# Altium project UDAC.PrjPcb
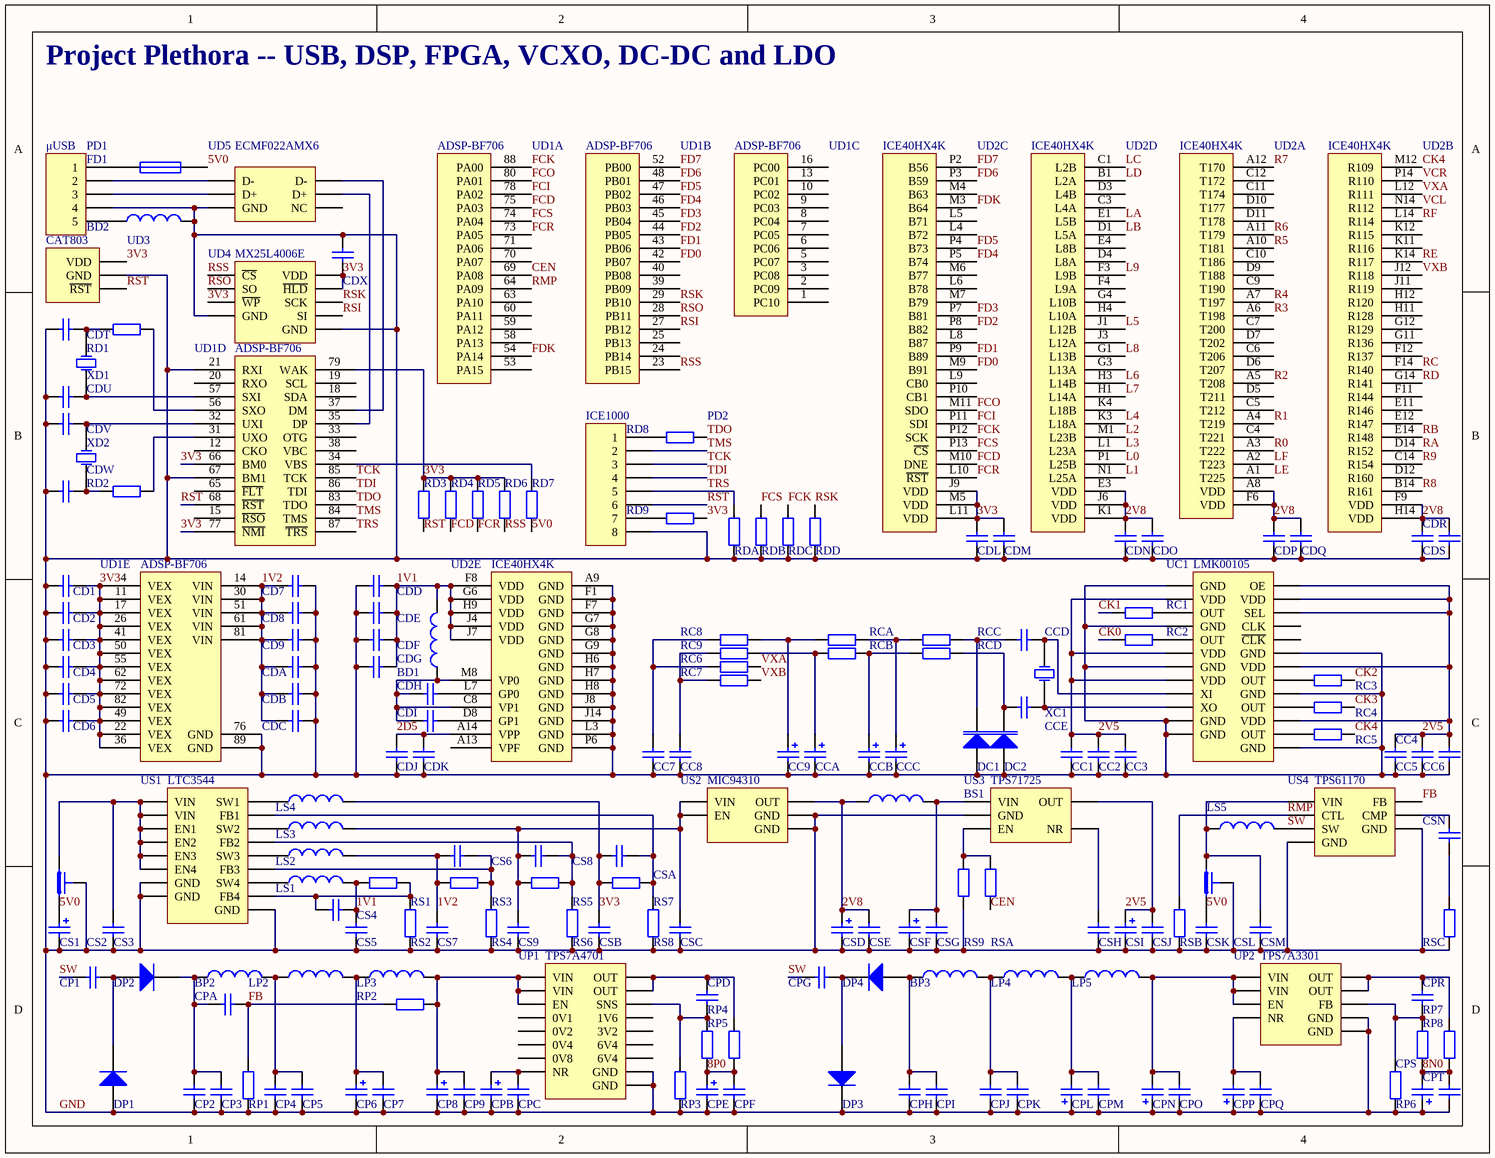
[diagram p0: USB.SchDoc]
2 sheets, 401 parts. Net scope: global (net labels, ports and power ports of the same name join across sheets).
Sheets:
  USB.SchDoc
  DAC.SchDoc

## Sheet USB.SchDoc
size Letter

### Parts
BD1  Inductor  [0402]  (value not drawn)
BD2  Inductor  [0402]  (value not drawn)
BP2  Inductor  [0402]  (value not drawn)
BP3  Inductor  [0402]  (value not drawn)
BS1  Inductor  [0402]  (value not drawn)
CC1  Cap  [0603]  (value not drawn)
CC2  Cap  [0402]  (value not drawn)
CC3  Cap  [0402]  (value not drawn)
CC4  Cap  [0402]  (value not drawn)
CC5  Cap  [0402]  (value not drawn)
CC6  Cap  [0402]  (value not drawn)
CC7  Cap  [0402]  (value not drawn)
CC8  Cap  [0402]  (value not drawn)
CC9  Cap Pol2  [0603]  (value not drawn)
CCA  Cap Pol2  [0603]  (value not drawn)
CCB  Cap Pol2  [0603]  (value not drawn)
CCC  Cap Pol2  [0603]  (value not drawn)
CCD  Cap  [0402]  (value not drawn)
CCE  Cap  [0402]  (value not drawn)
CD1  Cap  [0402]  (value not drawn)
CD2  Cap  [0402]  (value not drawn)
CD3  Cap  [0402]  (value not drawn)
CD4  Cap  [0402]  (value not drawn)
CD5  Cap  [0402]  (value not drawn)
CD6  Cap  [0402]  (value not drawn)
CD7  Cap  [0402]  (value not drawn)
CD8  Cap  [0402]  (value not drawn)
CD9  Cap  [0402]  (value not drawn)
CDA  Cap  [0402]  (value not drawn)
CDB  Cap  [0402]  (value not drawn)
CDC  Cap  [0402]  (value not drawn)
CDD  Cap  [0402]  (value not drawn)
CDE  Cap  [0402]  (value not drawn)
CDF  Cap  [0402]  (value not drawn)
CDG  Cap  [0402]  (value not drawn)
CDH  Cap  [0402]  (value not drawn)
CDI  Cap  [0402]  (value not drawn)
CDJ  Cap  [0402]  (value not drawn)
CDK  Cap  [0402]  (value not drawn)
CDL  Cap  [0402]  (value not drawn)
CDM  Cap  [0402]  (value not drawn)
CDN  Cap  [0402]  (value not drawn)
CDO  Cap  [0402]  (value not drawn)
CDP  Cap  [0402]  (value not drawn)
CDQ  Cap  [0402]  (value not drawn)
CDR  Cap  [0402]  (value not drawn)
CDS  Cap  [0402]  (value not drawn)
CDT  Cap  [0402]  (value not drawn)
CDU  Cap  [0402]  (value not drawn)
CDV  Cap  [0402]  (value not drawn)
CDW  Cap  [0402]  (value not drawn)
CDX  Cap  [0402]  (value not drawn)
CP1  Cap  [0402]  (value not drawn)
CP2  Cap  [0805]  (value not drawn)
CP3  Cap  [0805]  (value not drawn)
CP4  Cap  [0805]  (value not drawn)
CP5  Cap  [0805]  (value not drawn)
CP6  Cap Pol2  [6032]  (value not drawn)
CP7  Cap  [0805]  (value not drawn)
CP8  Cap Pol2  [6032]  (value not drawn)
CP9  Cap  [0805]  (value not drawn)
CPA  Cap  [0402]  (value not drawn)
CPB  Cap Pol2  [0603]  (value not drawn)
CPC  Cap  [0603]  (value not drawn)
CPD  Cap  [0402]  (value not drawn)
CPE  Cap Pol2  [6032]  (value not drawn)
CPF  Cap  [0805]  (value not drawn)
CPG  Cap  [0402]  (value not drawn)
CPH  Cap  [0805]  (value not drawn)
CPI  Cap  [0805]  (value not drawn)
CPJ  Cap  [0805]  (value not drawn)
CPK  Cap  [0805]  (value not drawn)
CPL  Cap Pol2  [6032]  (value not drawn)
CPM  Cap  [0805]  (value not drawn)
CPN  Cap Pol2  [6032]  (value not drawn)
CPO  Cap  [0805]  (value not drawn)
CPP  Cap Pol2  [0603]  (value not drawn)
CPQ  Cap  [0603]  (value not drawn)
CPR  Cap  [0402]  (value not drawn)
CPS  Cap Pol2  [6032]  (value not drawn)
CPT  Cap  [0805]  (value not drawn)
CS1  Cap Pol2  [0603]  (value not drawn)
CS2  Cap Feed  [0603F]  (value not drawn)
CS3  Cap  [0402]  (value not drawn)
CS4  Cap  [0402]  (value not drawn)
CS5  Cap  [0603]  (value not drawn)
CS6  Cap  [0402]  (value not drawn)
CS7  Cap  [0603]  (value not drawn)
CS8  Cap  [0402]  (value not drawn)
CS9  Cap  [0603]  (value not drawn)
CSA  Cap  [0402]  (value not drawn)
CSB  Cap  [0603]  (value not drawn)
CSC  Cap  [0402]  (value not drawn)
CSD  Cap Pol2  [0603]  (value not drawn)
CSE  Cap  [0603]  (value not drawn)
CSF  Cap Pol2  [0603]  (value not drawn)
CSG  Cap  [0603]  (value not drawn)
CSH  Cap  [0603]  (value not drawn)
CSI  Cap Pol2  [0603]  (value not drawn)
CSJ  Cap  [0603]  (value not drawn)
CSK  Cap  [0402]  (value not drawn)
CSL  Cap Feed  [0603F]  (value not drawn)
CSM  Cap  [0402]  (value not drawn)
CSN  Cap  [0402]  (value not drawn)
DC1  D Varactor  [SOD523]  (value not drawn)
DC2  D Varactor  [SOD523]  (value not drawn)
DP1  Diode  [SOD882]  (value not drawn)
DP2  Diode  [SOD882]  (value not drawn)
DP3  Diode  [SOD882]  (value not drawn)
DP4  Diode  [SOD882]  (value not drawn)
FD1  Fuse 1  [0402]  (value not drawn)
LP2  Inductor  [1210]  (value not drawn)
LP3  Inductor  [1210]  (value not drawn)
LP4  Inductor  [1210]  (value not drawn)
LP5  Inductor  [1210]  (value not drawn)
LS1  Inductor  [0805]  (value not drawn)
LS2  Inductor  [0805]  (value not drawn)
LS3  Inductor  [0805]  (value not drawn)
LS4  Inductor  [0805]  (value not drawn)
LS5  Inductor  [SRP2010]  (value not drawn)
PD1  μUSB  [HDR1X5]
PD2  ICE1000  [SOLO9188]
RC1  Res2  [0402]  (value not drawn)
RC2  Res2  [0402]  (value not drawn)
RC3  Res2  [0402]  (value not drawn)
RC4  Res2  [0402]  (value not drawn)
RC5  Res2  [0402]  (value not drawn)
RC6  Res2  [0402]  (value not drawn)
RC7  Res2  [0402]  (value not drawn)
RC8  Res2  [0402]  (value not drawn)
RC9  Res2  [0402]  (value not drawn)
RCA  Res2  [0402]  (value not drawn)
RCB  Res2  [0402]  (value not drawn)
RCC  Res2  [0402]  (value not drawn)
RCD  Res2  [0402]  (value not drawn)
RD1  Res2  [0402]  (value not drawn)
RD2  Res2  [0402]  (value not drawn)
RD3  Res2  [0402]  (value not drawn)
RD4  Res2  [0402]  (value not drawn)
RD5  Res2  [0402]  (value not drawn)
RD6  Res2  [0402]  (value not drawn)
RD7  Res2  [0402]  (value not drawn)
RD8  Res2  [0402]  (value not drawn)
RD9  Res2  [0402]  (value not drawn)
RDA  Res2  [0402]  (value not drawn)
RDB  Res2  [0402]  (value not drawn)
RDC  Res2  [0402]  (value not drawn)
RDD  Res2  [0402]  (value not drawn)
RP1  Res2  [0402]  (value not drawn)
RP2  Res2  [0402]  (value not drawn)
RP3  Res2  [0402]  (value not drawn)
RP4  Res2  [0402]  (value not drawn)
RP5  Res2  [0402]  (value not drawn)
RP6  Res2  [0402]  (value not drawn)
RP7  Res2  [0402]  (value not drawn)
RP8  Res2  [0402]  (value not drawn)
RS1  Res2  [0402]  (value not drawn)
RS2  Res2  [0402]  (value not drawn)
RS3  Res2  [0402]  (value not drawn)
RS4  Res2  [0402]  (value not drawn)
RS5  Res2  [0402]  (value not drawn)
RS6  Res2  [0402]  (value not drawn)
RS7  Res2  [0402]  (value not drawn)
RS8  Res2  [0402]  (value not drawn)
RS9  Res2  [0402]  (value not drawn)
RSA  Res2  [0402]  (value not drawn)
RSB  Res2  [0402]  (value not drawn)
RSC  Res2  [0402]  (value not drawn)
UC1  LMK00105  [QFN24]
UD1  ADSP-BF706  [QFN88]  (parts A,B,C,D,E of 5)
UD2  ICE40HX4K  [BGA132]  (parts A,B,C,D,E of 5)
UD3  CAT803  [SC70]
UD4  MX25L4006E  [UDFN8]
UD5  ECMF022AMX6  [UDFN6]
UP1  TPS7A4701  [QFN20]
UP2  TPS7A3301  [QFN20]
US1  LTC3544  [QFN16]
US2  MIC94310  [DFN4]
US3  TPS71725  [SC705]
US4  TPS61170  [DFN6]
XC1  XTAL  [2520]  (value not drawn)
XD1  XTAL  [2016]  (value not drawn)
XD2  XTAL  [2016]  (value not drawn)

### Nets
1V1: BD1.2 CDD.1 CDE.1 CDF.1 CDG.1 CS4.2 CS5.1 LS1.2 RS1.1 UD2.F8(VDD) UD2.G6(VDD) UD2.H9(VDD) UD2.J4(VDD) UD2.J7(VDD)
1V2: CD7.2 CD8.2 CD9.2 CDA.2 CDB.2 CDC.2 CS6.1 CS7.1 LS2.2 RS3.1 UD1.14(VIN) UD1.30(VIN) UD1.51(VIN) UD1.61(VIN) UD1.81(VIN)
2D5: CDJ.2 CDK.2 UD2.A14(VPP)
2V5: CC1.2 CC2.2 CC3.2 CC4.2 CC5.2 CC6.2 CSI.1 CSJ.2 UC1.2(VDD) UC1.6(VDD) UC1.8(VDD) UC1.14(VDD) UC1.18(VDD) UC1.22(SEL) UC1.23(VDD) UC1.24(OE) US3.5(OUT)
2V8: BS1.1 CDN.2 CDO.2 CDP.2 CDQ.2 CDR.2 CDS.2 CSD.1 CSE.2 UD2.A8(VDD) UD2.E3(VDD) UD2.F6(VDD) UD2.F9(VDD) UD2.H14(VDD) UD2.J6(VDD) UD2.K1(VDD) US2.1(OUT)
3V3: CD1.1 CD2.1 CD3.1 CD4.1 CD5.1 CD6.1 CDL.2 CDM.2 CDX.1 CSA.1 CSB.1 LS4.2 RD3.2 RD4.2 RD5.2 RD6.2 RD9.2 RS7.1 UD1.4(VEX) UD1.11(VEX) UD1.17(VEX) UD1.22(VEX) UD1.26(VEX) UD1.36(VEX) UD1.41(VEX) UD1.49(VEX) UD1.50(VEX) UD1.55(VEX) UD1.62(VEX) UD1.66(BM0) UD1.72(VEX) UD1.77(~{NMI}) UD1.79(WAK) UD1.82(VEX) UD2.J9(VDD) UD2.L11(VDD) UD2.M5(VDD) UD3.1(VDD) UD4.3(~{WP}) UD4.7(~{HLD}) UD4.8(VDD)
5V0: CS1.1 CS2.1 CSK.2 CSL.1 FD1.1 RD7.1
8N0: CPS.2 CPT.2 RP7.1 RP8.1
8P0: CPE.1 CPF.2 RP4.1 RP5.1
CEN: RSA.1 UD1.69(PA08)
CK0: RC2.1
CK1: RC1.1
CK2: RC3.2
CK3: RC4.2
CK4: RC5.2 UD2.M12(R109)
FB: CPA.1 RP1.2 RP2.1 US4.1(FB)
FCD: RD4.1 UD1.75(PA03) UD2.M10(DNE)
FCI: UD1.78(PA02) UD2.P11(SDI)
FCK: RDC.2 UD1.88(PA00) UD2.P12(SCK)
FCO: UD1.80(PA01) UD2.M11(SDO)
FCR: RD5.1 UD1.73(PA05) UD2.L10(~{RST})
FCS: RDB.2 UD1.74(PA04) UD2.P13(~{CS})
FD0: UD1.42(PB07) UD2.M9(B91)
FD1: UD1.43(PB06) UD2.P9(B89)
FD2: UD1.44(PB05) UD2.P8(B82)
FD3: UD1.45(PB04) UD2.P7(B81)
FD4: UD1.46(PB03) UD2.P5(B74)
FD5: UD1.47(PB02) UD2.P4(B73)
FD6: UD1.48(PB01) UD2.P3(B59)
FD7: UD1.52(PB00) UD2.P2(B56)
FDK: UD1.54(PA14) UD2.M3(B64)
GND: BD2.2 CC1.1 CC2.1 CC3.1 CC4.1 CC5.1 CC6.1 CC7.1 CC8.1 CC9.2 CCA.2 CCB.2 CCC.2 CD1.2 CD2.2 CD3.2 CD4.2 CD5.2 CD6.2 CD7.1 CD8.1 CD9.1 CDA.1 CDB.1 CDC.1 CDD.2 CDE.2 CDF.2 CDG.2 CDJ.1 CDK.1 CDL.1 CDM.1 CDN.1 CDO.1 CDP.1 CDQ.1 CDR.1 CDS.1 CDT.1 CDU.1 CDV.1 CDW.1 CDX.2 CP2.1 CP3.1 CP4.1 CP5.1 CP6.2 CP7.1 CP8.2 CP9.1 CPB.2 CPC.1 CPE.2 CPF.1 CPH.1 CPI.1 CPJ.1 CPK.1 CPL.1 CPM.1 CPN.1 CPO.1 CPP.1 CPQ.1 CPS.1 CPT.1 CS1.2 CS2.3 CS3.2 CS5.2 CS7.2 CS9.2 CSB.2 CSC.1 CSD.2 CSE.1 CSF.2 CSG.1 CSH.1 CSI.2 CSJ.1 CSK.1 CSL.3 CSM.1 DC1.3(A) DC2.3(A) DP1.1(A) DP3.2(K) PD1.4 PD2.8 RDA.1 RDB.1 RDC.1 RDD.1 RP1.1 RP3.2 RP6.1 RS2.1 RS4.1 RS6.1 RS8.1 RS9.1 RSB.1 RSC.1 UC1.1(GND) UC1.4(GND) UC1.7(GND) UC1.11(GND) UC1.12(GND) UC1.16(GND) UC1.19(GND) UC1.25(GND) UD1.21(RXI) UD1.67(BM1) UD1.76(GND) UD1.89(GND) UD2.A9(GND) UD2.F1(GND) UD2.F7(GND) UD2.G7(GND) UD2.G8(GND) UD2.G9(GND) UD2.H6(GND) UD2.H7(GND) UD2.H8(GND) UD2.J8(GND) UD2.J14(GND) UD2.L3(GND) UD2.P6(GND) UD3.2(GND) UD4.4(GND) UD4.9(GND) UD5.3(GND) UP1.7(GND) UP1.21(GND) UP2.7(GND) UP2.21(GND) US1.6(GND) US1.14(GND) US1.17(GND) US2.2(GND) US2.5(GND) US3.2(GND) US4.3(GND) US4.7(GND)
L0: UD2.P1(L25B)
L1: UD2.N1(L25A)
L2: UD2.M1(L23B)
L3: UD2.L1(L23A)
L4: UD2.K3(L18A)
L5: UD2.J1(L12B)
L6: UD2.H3(L14B)
L7: UD2.H1(L14A)
L8: UD2.G1(L13B)
L9: UD2.F3(L9B)
LA: UD2.E1(L5B)
LB: UD2.D1(L5A)
LC: UD2.C1(L2B)
LD: UD2.B1(L2A)
LE: UD2.A1(T225)
LF: UD2.A2(T223)
R0: UD2.A3(T222)
R1: UD2.A4(T219)
R2: UD2.A5(T208)
R3: UD2.A6(T198)
R4: UD2.A7(T197)
R5: UD2.A10(T181)
R6: UD2.A11(T179)
R7: UD2.A12(T170)
R8: UD2.B14(R161)
R9: UD2.C14(R154)
RA: UD2.D14(R152)
RB: UD2.E14(R148)
RC: UD2.F14(R140)
RD: UD2.G14(R141)
RE: UD2.K14(R117)
RF: UD2.L14(R114)
RMP: RSB.2 UD1.64(PA09) US4.5(CTL)
RSI: UD1.27(PB12) UD4.5(SI)
RSK: RDD.2 UD1.29(PB10) UD4.6(SCK)
RSO: UD1.28(PB11) UD4.2(SO)
RSS: RD6.1 UD1.23(PB15) UD4.1(~{CS})
RST: PD2.6 RD3.1 UD1.68(~{RST}) UD3.3(~{RST})
SW: CP1.1 CPG.1 LS5.2 US4.4(SW)
TCK: PD2.3 UD1.85(TCK)
TDI: PD2.4 UD1.86(TDI)
TDO: RD8.2 UD1.83(TDO)
TMS: PD2.2 UD1.84(TMS)
TRS: PD2.5 RDA.2 UD1.87(~{TRS})
VCL: UD2.N14(R112)
VCR: UD2.P14(R110)
VXA: RC6.2 UD2.L12(R111)
VXB: RC7.2 UD2.J12(R118)
NetBD1_1: BD1.1 CDH.1 CDI.1 UD2.C8(VP1) UD2.M8(VP0)
NetBD2_1: BD2.1 PD1.5
NetBP2_1: BP2.1 CP2.2 CP3.2 CPA.2 DP2.2(K)
NetBP2_2: BP2.2 CP4.2 CP5.2 LP2.1
NetBP3_1: BP3.1 CPH.2 CPI.2 DP4.1(A)
NetBP3_2: BP3.2 CPJ.2 CPK.2 LP4.1
NetBS1_2: BS1.2 CSF.1 CSG.2 US3.1(VIN)
NetCC7_2: CC7.2 RC6.1 RC8.1
NetCC8_2: CC8.2 RC7.1 RC9.1
NetCC9_1: CC9.1 RC8.2 RCA.1
NetCCA_1: CCA.1 RC9.2 RCB.1
NetCCB_1: CCB.1 RCB.2 RCD.1
NetCCC_1: CCC.1 RCA.2 RCC.1
NetCCD_1: CCD.1 DC1.1(K) RCC.2
NetCCD_2: CCD.2 UC1.9(XI) XC1.2(OSC2)
NetCCE_1: CCE.1 DC2.1(K) RCD.2
NetCCE_2: CCE.2 UC1.10(XO) XC1.1(OSC1)
NetCDH_2: CDH.2 UD2.L7(GP0)
NetCDI_2: CDI.2 UD2.D8(GP1)
NetCDT_2: CDT.2 RD1.1 XD1.2(OSC2)
NetCDU_2: CDU.2 UD1.57(SXI) XD1.1(OSC1)
NetCDV_2: CDV.2 UD1.32(UXI) XD2.2(OSC2)
NetCDW_2: CDW.2 RD2.1 XD2.1(OSC1)
NetCP1_2: CP1.2 DP1.2(K) DP2.1(A)
NetCP6_1: CP6.1 CP7.2 LP2.2 LP3.1
NetCP8_1: CP8.1 CP9.2 LP3.2 RP2.2 UP1.13(EN) UP1.15(VIN) UP1.16(VIN)
NetCPB_1: CPB.1 CPC.2 UP1.14(NR)
NetCPD_1: CPD.1 RP3.1 RP4.2 UP1.3(SNS)
NetCPD_2: CPD.2 RP5.2 UP1.1(OUT) UP1.20(OUT)
NetCPG_2: CPG.2 DP3.1(A) DP4.2(K)
NetCPL_2: CPL.2 CPM.2 LP4.2 LP5.1
NetCPN_2: CPN.2 CPO.2 LP5.2 UP2.13(EN) UP2.15(VIN) UP2.16(VIN)
NetCPP_2: CPP.2 CPQ.2 UP2.14(NR)
NetCPR_1: CPR.1 RP6.2 RP7.2 UP2.3(FB)
NetCPR_2: CPR.2 RP8.2 UP2.1(OUT) UP2.20(OUT)
NetCS2_2: CS2.2 CS3.1 US1.3(EN2) US1.7(VIN) US1.9(EN4) US1.12(EN1) US1.15(VIN) US1.16(EN3)
NetCS4_1: CS4.1 RS1.2 RS2.2 US1.10(FB4)
NetCS6_2: CS6.2 RS3.2 RS4.2 US1.1(FB3)
NetCS8_1: CS8.1 CS9.1 CSC.2 LS3.2 RS5.1 US2.3(EN) US2.4(VIN)
NetCS8_2: CS8.2 RS5.2 RS6.2 US1.2(FB2)
NetCSA_2: CSA.2 RS7.2 RS8.2 US1.11(FB1)
NetCSH_2: CSH.2 US3.4(NR)
NetCSL_2: CSL.2 CSM.2 LS5.1 US4.6(VIN)
NetCSN_1: CSN.1 RSC.2
NetCSN_2: CSN.2 US4.2(CMP)
NetFD1_2: FD1.2 PD1.1
NetLS1_1: LS1.1 US1.8(SW4)
NetLS2_1: LS2.1 US1.4(SW3)
NetLS3_1: LS3.1 US1.5(SW2)
NetLS4_1: LS4.1 US1.13(SW1)
NetPD1_2: PD1.2 UD5.1(D-)
NetPD1_3: PD1.3 UD5.2(D+)
NetPD2_1: PD2.1 RD8.1
NetPD2_7: PD2.7 RD9.1
NetRC1_2: RC1.2 UC1.3(OUT)
NetRC2_2: RC2.2 UC1.5(OUT)
NetRC3_1: RC3.1 UC1.17(OUT)
NetRC4_1: RC4.1 UC1.15(OUT)
NetRC5_1: RC5.1 UC1.13(OUT)
NetRD1_2: RD1.2 UD1.56(SXO)
NetRD2_2: RD2.2 UD1.31(UXO)
NetRD7_2: RD7.2 UD1.34(VBS)
NetRS9_2: RS9.2 RSA.2 US3.3(EN)
NetUD1_35: UD1.35(DP) UD5.5(D+)
NetUD1_37: UD1.37(DM) UD5.6(D-)

Not connected (* = marked no-connect by the designer): UC1 20(~{CLK}) 21(CLK); UD1 1(PC10) 2(PC09) 3(PC08) 5(PC07) 6(PC06) 7(PC05) 8(PC04) 9(PC03) 10(PC02) 12(CKO) 13(PC01) 15(~{RSO}) 16(PC00) 18(SDA) 19(SCL) 20(RXO) 24(PB14) 25(PB13) 33(OTG) 38(VBC) 39(PB09) 40(PB08) 53(PA15) 58(PA13) 59(PA12) 60(PA11) 63(PA10) 65(~{FLT}) 70(PA07) 71(PA06); UD2 A13(VPF) C3(L4A) C4(T221) C5(T212) C6(T206) C7(T200) C9(T190) C10(T186) C11(T174) C12(T172) D3(L4B) D4(L8A) D5(T211) D6(T207) D7(T202) D9(T188) D10(T177) D11(T178) D12(R160) E4(L8B) E11(R146) E12(R147) F4(L9A) F11(R144) F12(R137) G3(L13A) G4(L10B) G11(R136) G12(R129) H4(L10A) H11(R128) H12(R120) J3(L12A) J11(R119) K4(L18B) K11(R116) K12(R115) L4(B72) L5(B71) L6(B78) L8(B87) L9(CB0) M4(B63) M6(B77) M7(B79) P10(CB1); UD5 4(NC); UP1 4(6V4) 5(6V4) 6(3V2) 8(1V6) 9(0V8) 10(0V4) 11(0V2) 12(0V1)

### Notes on the sheet
- Project Plethora -- USB, DSP, FPGA, VCXO, DC-DC and LDO

### Library data of the parts
BD1 BD2 BP2 BP3 BS1 LP2-LP5 LS1-LS5 = Inductor: Code_IEC: 1005; Value: 10mH; Published: 8-Jun-2000; LatestRevisionDate: 29-May-2009; LatestRevisionNote: IPC-7351 Footprint Added.; PackageReference: 0402-A; Publisher: Altium Limited; PackageDescription: Chip Inductor; Code_JEITA: 0402
CC1-CC8 CCD CCE CD1-CD9 CDA CDB CDC CDD CDE CDF CDG CDH CDI CDJ CDK CDL CDM CDN CDO CDP CDQ CDR CDS CDT CDU CDV CDW CDX CP1-CP5 CP7 CP9 CPA CPC CPD CPF CPG CPH CPI CPJ CPK CPM CPO CPQ CPR CPT CS3-CS9 CSA CSB CSC CSE CSG CSH CSJ CSK CSM CSN = Cap: Capacitor; Value: 100pF; Published: 8-Jun-2000; LatestRevisionDate: 17-Jul-2002; LatestRevisionNote: Re-released for DXP Platform.; PackageReference: RAD-0.3; Publisher: Altium Limited; PackageDescription: Radial Cap, Thru-Hole; 2 Leads; 0.3 in Pin Spacing
CC9 CCA CCB CCC CP6 CP8 CPB CPE CPL CPN CPP CPS CS1 CSD CSF CSI = Cap Pol2: Polarized Capacitor (Axial); Value: 100pF; Published: 8-Jun-2000; LatestRevisionDate: 17-Jul-2002; LatestRevisionNote: Re-released for DXP Platform.; PackageReference: POLAR0.8; Publisher: Altium Limited; PackageDescription: Polarized Capacitor; 2 Leads
CS2 CSL = Cap Feed: Feed-Through Capacitor; Note: Commonly used for bypassing high-frequency currents to chassis; Value: 100pF; Published: 24-Mar-1999; LatestRevisionDate: 17-Jul-2002; LatestRevisionNote: Re-released for DXP Platform.; PackageReference: VR4; Publisher: Altium Limited; PackageDescription: Variable Resistor, Thru-Hole; 3 Leads
DC1 DC2 = D Varactor: Variable Capacitance Diode; Note: Pin 2 is not connected and not drawn.; Published: 8-Jun-2000; LatestRevisionDate: 29-May-2009; LatestRevisionNote: IPC-7351 Footprint Added.; DatasheetVersion: Jan-1998; PackageVersion: 1996; PackageReference: SOT23A; Publisher: Altium Limited; PackageDescription: 3-Pin SOT-23 Package 0.95 mm Pitch, 2.3 mm Lead Span - Reverse Pinning; ComponentLink1Description: Manufacturer Link; ComponentLink1URL: http://www.zetex.com/
DP1-DP4 = Diode: Default Diode; Published: 8-Jun-2000; LatestRevisionDate: 17-Jul-2002; LatestRevisionNote: Re-released for DXP Platform.; PackageVersion: Sep-1996; PackageReference: SMC; Publisher: Altium Limited; PackageDescription: DO-214-AB/SMC; 2 C-Bend Leads; Body 7.9 x 5.9 mm, inc. leads (LxW); Code_JEDEC: DO-214-AB
FD1 = Fuse 1: Fuse; Published: 8-Jun-2000; LatestRevisionDate: 17-Jul-2002; LatestRevisionNote: Re-released for DXP Platform.; PackageReference: PIN-W2/E2.8; Publisher: Altium Limited; PackageDescription: Thru-Hole; 2 Leads
PD1 = Header 5: Header, 5-Pin; LatestRevisionDate: 17-Jul-2002; LatestRevisionNote: Re-released for DXP Platform.; Publisher: Altium Limited
PD2 = Header 8: Header, 8-Pin; LatestRevisionDate: 17-Jul-2002; LatestRevisionNote: Re-released for DXP Platform.; Publisher: Altium Limited
RC1-RC9 RCA RCB RCC RCD RD1-RD9 RDA RDB RDC RDD RP1-RP8 RS1-RS9 RSA RSB RSC = Res2: Resistor; Value: 1K; Published: 8-Jun-2000; LatestRevisionDate: 17-Jul-2002; LatestRevisionNote: Re-released for DXP Platform.; PackageReference: AXIAL-0.4; Publisher: Altium Limited; PackageDescription: Axial Device, Thru-Hole; 2 Leads; 0.4 in Pin Spacing
UD2 = ICE40HX4K: Manufacturer: Lattice Semiconductor; PartNumber: ICE40HX4K-CB132; Embedded RAM Bits: 80K; Logic Cells: 3520; Packing: Tray; Phase-Locked Loops: 2; Supply Voltage: 1.2V; DatasheetVersion: Rev. 02.9; PackageVersion: Rev. 03.9, 02/2013; PackageReference: csBGA-132; PackageDescription: 132-Ball Chip Scale Ball Grid Array, Body 8 x 8 mm, Pitch 0.5 mm; Supplier 1: Digi-Key; Supplier Part Number 1: 220-1571-ND; Supplier 2: Farnell; Supplier Part Number 2: 2252859; Supplier 3: Newark; Supplier Part Number 3: 48W5878; Supplier 4: Mouser; Supplier Part Number 4: 842-ICE40HX4K-CB132; RoHS: TRUE; Mounting Technology: Surface Mount; ComponentLink1Description: Manufacturer URL; ComponentLink1URL: http://www.latticesemi.com/en; ComponentLink2Description: Datasheet; ComponentLink2URL: http://www.latticesemi.com/~/media/Documents/DataSheets/iCE/iCE40LPHXFamilyDataSheet.pdf; ComponentLink3Description: Package Specification; ComponentLink3URL: http://www.latticesemi.com/lit/docs/package/pkg.pdf
XC1 XD1 XD2 = XTAL: Crystal Oscillator; Published: 8-Jun-2000; LatestRevisionDate: 17-Jul-2002; LatestRevisionNote: Re-released for DXP Platform.; PackageReference: R38; Publisher: Altium Limited; PackageDescription: Crystal, Thru-Hole; 2 Leads; Body 3.1 x 8.2 mm (Dia.xH)

## Sheet DAC.SchDoc
size Letter
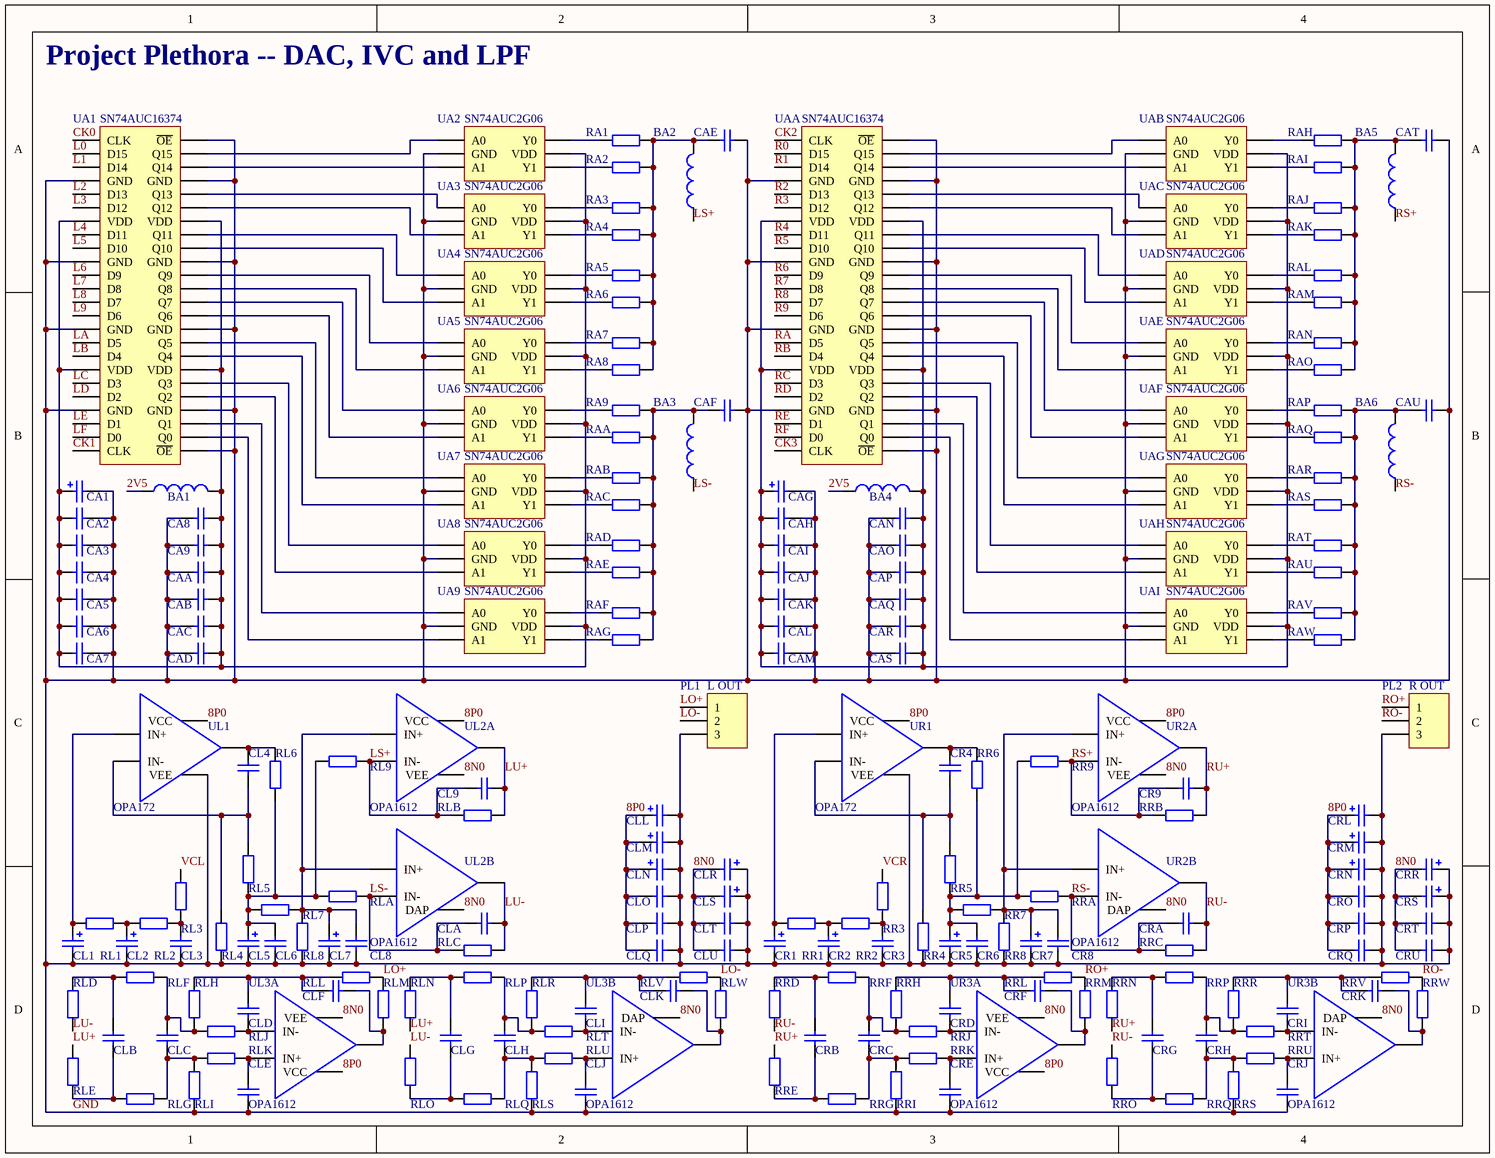
[diagram p1: DAC.SchDoc]

### Parts
BA1  Inductor  [0402]  (value not drawn)
BA2  Inductor  [0402]  (value not drawn)
BA3  Inductor  [0402]  (value not drawn)
BA4  Inductor  [0402]  (value not drawn)
BA5  Inductor  [0402]  (value not drawn)
BA6  Inductor  [0402]  (value not drawn)
CA1  Cap Pol2  [0603]  (value not drawn)
CA2  Cap  [0402]  (value not drawn)
CA3  Cap  [0402]  (value not drawn)
CA4  Cap  [0402]  (value not drawn)
CA5  Cap  [0402]  (value not drawn)
CA6  Cap  [0402]  (value not drawn)
CA7  Cap  [0402]  (value not drawn)
CA8  Cap  [0402]  (value not drawn)
CA9  Cap  [0402]  (value not drawn)
CAA  Cap  [0402]  (value not drawn)
CAB  Cap  [0402]  (value not drawn)
CAC  Cap  [0402]  (value not drawn)
CAD  Cap  [0402]  (value not drawn)
CAE  Cap  [0402]  (value not drawn)
CAF  Cap  [0402]  (value not drawn)
CAG  Cap Pol2  [0603]  (value not drawn)
CAH  Cap  [0402]  (value not drawn)
CAI  Cap  [0402]  (value not drawn)
CAJ  Cap  [0402]  (value not drawn)
CAK  Cap  [0402]  (value not drawn)
CAL  Cap  [0402]  (value not drawn)
CAM  Cap  [0402]  (value not drawn)
CAN  Cap  [0402]  (value not drawn)
CAO  Cap  [0402]  (value not drawn)
CAP  Cap  [0402]  (value not drawn)
CAQ  Cap  [0402]  (value not drawn)
CAR  Cap  [0402]  (value not drawn)
CAS  Cap  [0402]  (value not drawn)
CAT  Cap  [0402]  (value not drawn)
CAU  Cap  [0402]  (value not drawn)
CL1  Cap Pol2  [0603]  (value not drawn)
CL2  Cap Pol2  [0603]  (value not drawn)
CL3  Cap  [0603]  (value not drawn)
CL4  Cap  [0603]  (value not drawn)
CL5  Cap Pol2  [0603]  (value not drawn)
CL6  Cap  [0603]  (value not drawn)
CL7  Cap Pol2  [0603]  (value not drawn)
CL8  Cap  [0603]  (value not drawn)
CL9  Cap  [0603]  (value not drawn)
CLA  Cap  [0603]  (value not drawn)
CLB  Cap  [0603]  (value not drawn)
CLC  Cap  [0603]  (value not drawn)
CLD  Cap  [0603]  (value not drawn)
CLE  Cap  [0603]  (value not drawn)
CLF  Cap  [0603]  (value not drawn)
CLG  Cap  [0603]  (value not drawn)
CLH  Cap  [0603]  (value not drawn)
CLI  Cap  [0603]  (value not drawn)
CLJ  Cap  [0603]  (value not drawn)
CLK  Cap  [0603]  (value not drawn)
CLL  Cap Pol2  [0603]  (value not drawn)
CLM  Cap Pol2  [0603]  (value not drawn)
CLN  Cap Pol2  [0603]  (value not drawn)
CLO  Cap  [0603]  (value not drawn)
CLP  Cap  [0603]  (value not drawn)
CLQ  Cap  [0603]  (value not drawn)
CLR  Cap Pol2  [0603]  (value not drawn)
CLS  Cap Pol2  [0603]  (value not drawn)
CLT  Cap  [0603]  (value not drawn)
CLU  Cap  [0603]  (value not drawn)
CR1  Cap Pol2  [0603]  (value not drawn)
CR2  Cap Pol2  [0603]  (value not drawn)
CR3  Cap  [0603]  (value not drawn)
CR4  Cap  [0603]  (value not drawn)
CR5  Cap Pol2  [0603]  (value not drawn)
CR6  Cap  [0603]  (value not drawn)
CR7  Cap Pol2  [0603]  (value not drawn)
CR8  Cap  [0603]  (value not drawn)
CR9  Cap  [0603]  (value not drawn)
CRA  Cap  [0603]  (value not drawn)
CRB  Cap  [0603]  (value not drawn)
CRC  Cap  [0603]  (value not drawn)
CRD  Cap  [0603]  (value not drawn)
CRE  Cap  [0603]  (value not drawn)
CRF  Cap  [0603]  (value not drawn)
CRG  Cap  [0603]  (value not drawn)
CRH  Cap  [0603]  (value not drawn)
CRI  Cap  [0603]  (value not drawn)
CRJ  Cap  [0603]  (value not drawn)
CRK  Cap  [0603]  (value not drawn)
CRL  Cap Pol2  [0603]  (value not drawn)
CRM  Cap Pol2  [0603]  (value not drawn)
CRN  Cap Pol2  [0603]  (value not drawn)
CRO  Cap  [0603]  (value not drawn)
CRP  Cap  [0603]  (value not drawn)
CRQ  Cap  [0603]  (value not drawn)
CRR  Cap Pol2  [0603]  (value not drawn)
CRS  Cap Pol2  [0603]  (value not drawn)
CRT  Cap  [0603]  (value not drawn)
CRU  Cap  [0603]  (value not drawn)
PL1  L OUT  [HDR1X3]
PL2  R OUT  [HDR1X3]
RA1  Res2  [0402]  (value not drawn)
RA2  Res2  [0402]  (value not drawn)
RA3  Res2  [0402]  (value not drawn)
RA4  Res2  [0402]  (value not drawn)
RA5  Res2  [0402]  (value not drawn)
RA6  Res2  [0402]  (value not drawn)
RA7  Res2  [0402]  (value not drawn)
RA8  Res2  [0402]  (value not drawn)
RA9  Res2  [0402]  (value not drawn)
RAA  Res2  [0402]  (value not drawn)
RAB  Res2  [0402]  (value not drawn)
RAC  Res2  [0402]  (value not drawn)
RAD  Res2  [0402]  (value not drawn)
RAE  Res2  [0402]  (value not drawn)
RAF  Res2  [0402]  (value not drawn)
RAG  Res2  [0402]  (value not drawn)
RAH  Res2  [0402]  (value not drawn)
RAI  Res2  [0402]  (value not drawn)
RAJ  Res2  [0402]  (value not drawn)
RAK  Res2  [0402]  (value not drawn)
RAL  Res2  [0402]  (value not drawn)
RAM  Res2  [0402]  (value not drawn)
RAN  Res2  [0402]  (value not drawn)
RAO  Res2  [0402]  (value not drawn)
RAP  Res2  [0402]  (value not drawn)
RAQ  Res2  [0402]  (value not drawn)
RAR  Res2  [0402]  (value not drawn)
RAS  Res2  [0402]  (value not drawn)
RAT  Res2  [0402]  (value not drawn)
RAU  Res2  [0402]  (value not drawn)
RAV  Res2  [0402]  (value not drawn)
RAW  Res2  [0402]  (value not drawn)
RL1  Res2  [0402]  (value not drawn)
RL2  Res2  [0402]  (value not drawn)
RL3  Res2  [0402]  (value not drawn)
RL4  Res2  [0402]  (value not drawn)
RL5  Res2  [0402]  (value not drawn)
RL6  Res2  [0402]  (value not drawn)
RL7  Res2  [0402]  (value not drawn)
RL8  Res2  [0402]  (value not drawn)
RL9  Res2  [0402]  (value not drawn)
RLA  Res2  [0402]  (value not drawn)
RLB  Res2  [0402]  (value not drawn)
RLC  Res2  [0402]  (value not drawn)
RLD  Res2  [0402]  (value not drawn)
RLE  Res2  [0402]  (value not drawn)
RLF  Res2  [0402]  (value not drawn)
RLG  Res2  [0402]  (value not drawn)
RLH  Res2  [0402]  (value not drawn)
RLI  Res2  [0402]  (value not drawn)
RLJ  Res2  [0402]  (value not drawn)
RLK  Res2  [0402]  (value not drawn)
RLL  Res2  [0402]  (value not drawn)
RLM  Res2  [0402]  (value not drawn)
RLN  Res2  [0402]  (value not drawn)
RLO  Res2  [0402]  (value not drawn)
RLP  Res2  [0402]  (value not drawn)
RLQ  Res2  [0402]  (value not drawn)
RLR  Res2  [0402]  (value not drawn)
RLS  Res2  [0402]  (value not drawn)
RLT  Res2  [0402]  (value not drawn)
RLU  Res2  [0402]  (value not drawn)
RLV  Res2  [0402]  (value not drawn)
RLW  Res2  [0402]  (value not drawn)
RR1  Res2  [0402]  (value not drawn)
RR2  Res2  [0402]  (value not drawn)
RR3  Res2  [0402]  (value not drawn)
RR4  Res2  [0402]  (value not drawn)
RR5  Res2  [0402]  (value not drawn)
RR6  Res2  [0402]  (value not drawn)
RR7  Res2  [0402]  (value not drawn)
RR8  Res2  [0402]  (value not drawn)
RR9  Res2  [0402]  (value not drawn)
RRA  Res2  [0402]  (value not drawn)
RRB  Res2  [0402]  (value not drawn)
RRC  Res2  [0402]  (value not drawn)
RRD  Res2  [0402]  (value not drawn)
RRE  Res2  [0402]  (value not drawn)
RRF  Res2  [0402]  (value not drawn)
RRG  Res2  [0402]  (value not drawn)
RRH  Res2  [0402]  (value not drawn)
RRI  Res2  [0402]  (value not drawn)
RRJ  Res2  [0402]  (value not drawn)
RRK  Res2  [0402]  (value not drawn)
RRL  Res2  [0402]  (value not drawn)
RRM  Res2  [0402]  (value not drawn)
RRN  Res2  [0402]  (value not drawn)
RRO  Res2  [0402]  (value not drawn)
RRP  Res2  [0402]  (value not drawn)
RRQ  Res2  [0402]  (value not drawn)
RRR  Res2  [0402]  (value not drawn)
RRS  Res2  [0402]  (value not drawn)
RRT  Res2  [0402]  (value not drawn)
RRU  Res2  [0402]  (value not drawn)
RRV  Res2  [0402]  (value not drawn)
RRW  Res2  [0402]  (value not drawn)
UA1  SN74AUC16374  [TSSOP48]
UA2  SN74AUC2G06  [SC706]
UA3  SN74AUC2G06  [SC706]
UA4  SN74AUC2G06  [SC706]
UA5  SN74AUC2G06  [SC706]
UA6  SN74AUC2G06  [SC706]
UA7  SN74AUC2G06  [SC706]
UA8  SN74AUC2G06  [SC706]
UA9  SN74AUC2G06  [SC706]
UAA  SN74AUC16374  [TSSOP48]
UAB  SN74AUC2G06  [SC706]
UAC  SN74AUC2G06  [SC706]
UAD  SN74AUC2G06  [SC706]
UAE  SN74AUC2G06  [SC706]
UAF  SN74AUC2G06  [SC706]
UAG  SN74AUC2G06  [SC706]
UAH  SN74AUC2G06  [SC706]
UAI  SN74AUC2G06  [SC706]
UL1  OPA172  [SC705]
UL2  OPA1612  [DFN8]  (parts A,B of 2)
UL3  OPA1612  [DFN8]  (parts A,B of 2)
UR1  OPA172  [SC705]
UR2  OPA1612  [DFN8]  (parts A,B of 2)
UR3  OPA1612  [DFN8]  (parts A,B of 2)

### Nets
2V5: BA1.1 BA4.1
8N0: CLR.2 CLS.2 CLT.1 CLU.1 CRR.2 CRS.2 CRT.1 CRU.1 UL2.4(VEE) UL2.9(DAP) UL3.4(VEE) UL3.9(DAP) UR2.4(VEE) UR2.9(DAP) UR3.4(VEE) UR3.9(DAP)
8P0: CLL.1 CLM.1 CLN.1 CLO.2 CLP.2 CLQ.2 CRL.1 CRM.1 CRN.1 CRO.2 CRP.2 CRQ.2 UL1.5(VCC) UL2.8(VCC) UL3.8(VCC) UR1.5(VCC) UR2.8(VCC) UR3.8(VCC)
CK0: UA1.25(CLK)
CK1: UA1.48(CLK)
CK2: UAA.25(CLK)
CK3: UAA.48(CLK)
GND: CA1.2 CA2.2 CA3.2 CA4.2 CA5.2 CA6.2 CA7.2 CA8.1 CA9.1 CAA.1 CAB.1 CAC.1 CAD.1 CAE.1 CAF.1 CAG.2 CAH.2 CAI.2 CAJ.2 CAK.2 CAL.2 CAM.2 CAN.1 CAO.1 CAP.1 CAQ.1 CAR.1 CAS.1 CAT.1 CAU.1 CL1.2 CL2.2 CL3.1 CL5.2 CL6.1 CL7.2 CL8.1 CLE.2 CLJ.2 CLL.2 CLM.2 CLN.2 CLO.1 CLP.1 CLQ.1 CLR.1 CLS.1 CLT.2 CLU.2 CR1.2 CR2.2 CR3.1 CR5.2 CR6.1 CR7.2 CR8.1 CRE.2 CRJ.2 CRL.2 CRM.2 CRN.2 CRO.1 CRP.1 CRQ.1 CRR.1 CRS.1 CRT.2 CRU.2 PL1.3 PL2.3 RL4.1 RL8.1 RLI.1 RLS.1 RR4.1 RR8.1 RRI.1 RRS.1 UA1.1(~{OE}) UA1.4(GND) UA1.10(GND) UA1.15(GND) UA1.21(GND) UA1.24(~{OE}) UA1.28(GND) UA1.34(GND) UA1.39(GND) UA1.45(GND) UA2.2(GND) UA3.2(GND) UA4.2(GND) UA5.2(GND) UA6.2(GND) UA7.2(GND) UA8.2(GND) UA9.2(GND) UAA.1(~{OE}) UAA.4(GND) UAA.10(GND) UAA.15(GND) UAA.21(GND) UAA.24(~{OE}) UAA.28(GND) UAA.34(GND) UAA.39(GND) UAA.45(GND) UAB.2(GND) UAC.2(GND) UAD.2(GND) UAE.2(GND) UAF.2(GND) UAG.2(GND) UAH.2(GND) UAI.2(GND) UL1.2(VEE) UR1.2(VEE)
L0: UA1.26(D15)
L1: UA1.27(D14)
L2: UA1.29(D13)
L3: UA1.30(D12)
L4: UA1.32(D11)
L5: UA1.33(D10)
L6: UA1.35(D9)
L7: UA1.36(D8)
L8: UA1.37(D7)
L9: UA1.38(D6)
LA: UA1.40(D5)
LB: UA1.41(D4)
LC: UA1.43(D3)
LD: UA1.44(D2)
LE: UA1.46(D1)
LF: UA1.47(D0)
LO+: PL1.1 RLL.2 RLM.1
LO-: PL1.2 RLV.2 RLW.1
LS+: BA2.1 CL9.2 RL9.2 RLB.1 UL2.2(IN-)
LS-: BA3.1 CLA.2 RLA.2 RLC.1 UL2.6(IN-)
LU+: CL9.1 RLB.2 RLE.2 RLN.1 UL2.1
LU-: CLA.1 RLC.2 RLD.1 RLO.2 UL2.7
R0: UAA.26(D15)
R1: UAA.27(D14)
R2: UAA.29(D13)
R3: UAA.30(D12)
R4: UAA.32(D11)
R5: UAA.33(D10)
R6: UAA.35(D9)
R7: UAA.36(D8)
R8: UAA.37(D7)
R9: UAA.38(D6)
RA: UAA.40(D5)
RB: UAA.41(D4)
RC: UAA.43(D3)
RD: UAA.44(D2)
RE: UAA.46(D1)
RF: UAA.47(D0)
RO+: PL2.1 RRL.2 RRM.1
RO-: PL2.2 RRV.2 RRW.1
RS+: BA5.1 CR9.2 RR9.2 RRB.1 UR2.2(IN-)
RS-: BA6.1 CRA.2 RRA.2 RRC.1 UR2.6(IN-)
RU+: CR9.1 RRB.2 RRE.2 RRN.1 UR2.1
RU-: CRA.1 RRC.2 RRD.1 RRO.2 UR2.7
VCL: RL3.2
VCR: RR3.2
NetBA1_2: BA1.2 CA1.1 CA2.1 CA3.1 CA4.1 CA5.1 CA6.1 CA7.1 CA8.2 CA9.2 CAA.2 CAB.2 CAC.2 CAD.2 UA1.7(VDD) UA1.18(VDD) UA1.31(VDD) UA1.42(VDD) UA2.5(VDD) UA3.5(VDD) UA4.5(VDD) UA5.5(VDD) UA6.5(VDD) UA7.5(VDD) UA8.5(VDD) UA9.5(VDD)
NetBA2_2: BA2.2 CAE.2 RA1.2 RA2.2 RA3.2 RA4.2 RA5.2 RA6.2 RA7.2 RA8.2
NetBA3_2: BA3.2 CAF.2 RA9.2 RAA.2 RAB.2 RAC.2 RAD.2 RAE.2 RAF.2 RAG.2
NetBA4_2: BA4.2 CAG.1 CAH.1 CAI.1 CAJ.1 CAK.1 CAL.1 CAM.1 CAN.2 CAO.2 CAP.2 CAQ.2 CAR.2 CAS.2 UAA.7(VDD) UAA.18(VDD) UAA.31(VDD) UAA.42(VDD) UAB.5(VDD) UAC.5(VDD) UAD.5(VDD) UAE.5(VDD) UAF.5(VDD) UAG.5(VDD) UAH.5(VDD) UAI.5(VDD)
NetBA5_2: BA5.2 CAT.2 RAH.2 RAI.2 RAJ.2 RAK.2 RAL.2 RAM.2 RAN.2 RAO.2
NetBA6_2: BA6.2 CAU.2 RAP.2 RAQ.2 RAR.2 RAS.2 RAT.2 RAU.2 RAV.2 RAW.2
NetCL1_1: CL1.1 RL1.1 UL1.3(IN+)
NetCL2_1: CL2.1 RL1.2 RL2.2
NetCL3_2: CL3.2 RL2.1 RL3.1
NetCL4_1: CL4.1 RL4.2 RL5.2 UL1.4(IN-)
NetCL4_2: CL4.2 RL6.2 UL1.1
NetCL5_1: CL5.1 CL6.2 RL5.1 RL6.1 RL7.2 RL9.1 RLA.1
NetCL7_1: CL7.1 CL8.2 RL7.1 RL8.2 UL2.3(IN+) UL2.5(IN+)
NetCLB_1: CLB.1 RLE.1 RLG.2
NetCLB_2: CLB.2 RLD.2 RLF.2
NetCLC_1: CLC.1 RLG.1 RLI.2 RLK.2
NetCLC_2: CLC.2 RLF.1 RLH.1 RLJ.2
NetCLD_1: CLD.1 RLJ.1 UL3.2(IN-)
NetCLD_2: CLD.2 CLF.2 RLH.2 RLL.1
NetCLE_1: CLE.1 RLK.1 UL3.3(IN+)
NetCLF_1: CLF.1 RLM.2 UL3.1
NetCLG_1: CLG.1 RLO.1 RLQ.2
NetCLG_2: CLG.2 RLN.2 RLP.2
NetCLH_1: CLH.1 RLQ.1 RLS.2 RLU.2
NetCLH_2: CLH.2 RLP.1 RLR.1 RLT.2
NetCLI_1: CLI.1 RLT.1 UL3.6(IN-)
NetCLI_2: CLI.2 CLK.1 RLR.2 RLV.1
NetCLJ_1: CLJ.1 RLU.1 UL3.5(IN+)
NetCLK_2: CLK.2 RLW.2 UL3.7
NetCR1_1: CR1.1 RR1.1 UR1.3(IN+)
NetCR2_1: CR2.1 RR1.2 RR2.2
NetCR3_2: CR3.2 RR2.1 RR3.1
NetCR4_1: CR4.1 RR4.2 RR5.2 UR1.4(IN-)
NetCR4_2: CR4.2 RR6.2 UR1.1
NetCR5_1: CR5.1 CR6.2 RR5.1 RR6.1 RR7.2 RR9.1 RRA.1
NetCR7_1: CR7.1 CR8.2 RR7.1 RR8.2 UR2.3(IN+) UR2.5(IN+)
NetCRB_1: CRB.1 RRE.1 RRG.2
NetCRB_2: CRB.2 RRD.2 RRF.2
NetCRC_1: CRC.1 RRG.1 RRI.2 RRK.2
NetCRC_2: CRC.2 RRF.1 RRH.1 RRJ.2
NetCRD_1: CRD.1 RRJ.1 UR3.2(IN-)
NetCRD_2: CRD.2 CRF.1 RRH.2 RRL.1
NetCRE_1: CRE.1 RRK.1 UR3.3(IN+)
NetCRF_2: CRF.2 RRM.2 UR3.1
NetCRG_1: CRG.1 RRO.1 RRQ.2
NetCRG_2: CRG.2 RRN.2 RRP.2
NetCRH_1: CRH.1 RRQ.1 RRS.2 RRU.2
NetCRH_2: CRH.2 RRP.1 RRR.1 RRT.2
NetCRI_1: CRI.1 RRT.1 UR3.6(IN-)
NetCRI_2: CRI.2 CRK.1 RRR.2 RRV.1
NetCRJ_1: CRJ.1 RRU.1 UR3.5(IN+)
NetCRK_2: CRK.2 RRW.2 UR3.7
NetRA1_1: RA1.1 UA2.6(Y0)
NetRA2_1: RA2.1 UA2.4(Y1)
NetRA3_1: RA3.1 UA3.6(Y0)
NetRA4_1: RA4.1 UA3.4(Y1)
NetRA5_1: RA5.1 UA4.6(Y0)
NetRA6_1: RA6.1 UA4.4(Y1)
NetRA7_1: RA7.1 UA5.6(Y0)
NetRA8_1: RA8.1 UA5.4(Y1)
NetRA9_1: RA9.1 UA6.6(Y0)
NetRAA_1: RAA.1 UA6.4(Y1)
NetRAB_1: RAB.1 UA7.6(Y0)
NetRAC_1: RAC.1 UA7.4(Y1)
NetRAD_1: RAD.1 UA8.6(Y0)
NetRAE_1: RAE.1 UA8.4(Y1)
NetRAF_1: RAF.1 UA9.6(Y0)
NetRAG_1: RAG.1 UA9.4(Y1)
NetRAH_1: RAH.1 UAB.6(Y0)
NetRAI_1: RAI.1 UAB.4(Y1)
NetRAJ_1: RAJ.1 UAC.6(Y0)
NetRAK_1: RAK.1 UAC.4(Y1)
NetRAL_1: RAL.1 UAD.6(Y0)
NetRAM_1: RAM.1 UAD.4(Y1)
NetRAN_1: RAN.1 UAE.6(Y0)
NetRAO_1: RAO.1 UAE.4(Y1)
NetRAP_1: RAP.1 UAF.6(Y0)
NetRAQ_1: RAQ.1 UAF.4(Y1)
NetRAR_1: RAR.1 UAG.6(Y0)
NetRAS_1: RAS.1 UAG.4(Y1)
NetRAT_1: RAT.1 UAH.6(Y0)
NetRAU_1: RAU.1 UAH.4(Y1)
NetRAV_1: RAV.1 UAI.6(Y0)
NetRAW_1: RAW.1 UAI.4(Y1)
NetUA1_2: UA1.2(Q0) UA9.3(A1)
NetUA1_3: UA1.3(Q1) UA9.1(A0)
NetUA1_5: UA1.5(Q2) UA8.3(A1)
NetUA1_6: UA1.6(Q3) UA8.1(A0)
NetUA1_8: UA1.8(Q4) UA7.3(A1)
NetUA1_9: UA1.9(Q5) UA7.1(A0)
NetUA1_11: UA1.11(Q6) UA6.3(A1)
NetUA1_12: UA1.12(Q7) UA6.1(A0)
NetUA1_13: UA1.13(Q8) UA5.3(A1)
NetUA1_14: UA1.14(Q9) UA5.1(A0)
NetUA1_16: UA1.16(Q10) UA4.3(A1)
NetUA1_17: UA1.17(Q11) UA4.1(A0)
NetUA1_19: UA1.19(Q12) UA3.3(A1)
NetUA1_20: UA1.20(Q13) UA3.1(A0)
NetUA1_22: UA1.22(Q14) UA2.3(A1)
NetUA1_23: UA1.23(Q15) UA2.1(A0)
NetUAA_2: UAA.2(Q0) UAI.3(A1)
NetUAA_3: UAA.3(Q1) UAI.1(A0)
NetUAA_5: UAA.5(Q2) UAH.3(A1)
NetUAA_6: UAA.6(Q3) UAH.1(A0)
NetUAA_8: UAA.8(Q4) UAG.3(A1)
NetUAA_9: UAA.9(Q5) UAG.1(A0)
NetUAA_11: UAA.11(Q6) UAF.3(A1)
NetUAA_12: UAA.12(Q7) UAF.1(A0)
NetUAA_13: UAA.13(Q8) UAE.3(A1)
NetUAA_14: UAA.14(Q9) UAE.1(A0)
NetUAA_16: UAA.16(Q10) UAD.3(A1)
NetUAA_17: UAA.17(Q11) UAD.1(A0)
NetUAA_19: UAA.19(Q12) UAC.3(A1)
NetUAA_20: UAA.20(Q13) UAC.1(A0)
NetUAA_22: UAA.22(Q14) UAB.3(A1)
NetUAA_23: UAA.23(Q15) UAB.1(A0)

### Notes on the sheet
- Project Plethora -- DAC, IVC and LPF

### Library data of the parts
BA1-BA6 = Inductor: Code_IEC: 1005; Value: 10mH; Published: 8-Jun-2000; LatestRevisionDate: 29-May-2009; LatestRevisionNote: IPC-7351 Footprint Added.; PackageReference: 0402-A; Publisher: Altium Limited; PackageDescription: Chip Inductor; Code_JEITA: 0402
CA1 CAG CL1 CL2 CL5 CL7 CLL CLM CLN CLR CLS CR1 CR2 CR5 CR7 CRL CRM CRN CRR CRS = Cap Pol2: as CC9 on sheet USB; Published: 8-Jun-2000; LatestRevisionDate: 17-Jul-2002; LatestRevisionNote: Re-released for DXP Platform.; PackageReference: POLAR0.8; Publisher: Altium Limited; PackageDescription: Polarized Capacitor; 2 Leads
CA2-CA9 CAA CAB CAC CAD CAE CAF CAH CAI CAJ CAK CAL CAM CAN CAO CAP CAQ CAR CAS CAT CAU CL3 CL4 CL6 CL8 CL9 CLA CLB CLC CLD CLE CLF CLG CLH CLI CLJ CLK CLO CLP CLQ CLT CLU CR3 CR4 CR6 CR8 CR9 CRA CRB CRC CRD CRE CRF CRG CRH CRI CRJ CRK CRO CRP CRQ CRT CRU = Cap: Capacitor; Value: 100pF; Published: 8-Jun-2000; LatestRevisionDate: 17-Jul-2002; LatestRevisionNote: Re-released for DXP Platform.; PackageReference: RAD-0.3; Publisher: Altium Limited; PackageDescription: Radial Cap, Thru-Hole; 2 Leads; 0.3 in Pin Spacing
PL1 PL2 = Header 3: Header, 3-Pin; LatestRevisionDate: 17-Jul-2002; LatestRevisionNote: Re-released for DXP Platform.; Publisher: Altium Limited
RA1-RA9 RAA RAB RAC RAD RAE RAF RAG RAH RAI RAJ RAK RAL RAM RAN RAO RAP RAQ RAR RAS RAT RAU RAV RAW RL1-RL9 RLA RLB RLC RLD RLE RLF RLG RLH RLI RLJ RLK RLL RLM RLN RLO RLP RLQ RLR RLS RLT RLU RLV RLW RR1-RR9 RRA RRB RRC RRD RRE RRF RRG RRH RRI RRJ RRK RRL RRM RRN RRO RRP RRQ RRR RRS RRT RRU RRV RRW = Res2: Resistor; Value: 1K; Published: 8-Jun-2000; LatestRevisionDate: 17-Jul-2002; LatestRevisionNote: Re-released for DXP Platform.; PackageReference: AXIAL-0.4; Publisher: Altium Limited; PackageDescription: Axial Device, Thru-Hole; 2 Leads; 0.4 in Pin Spacing

## Nets that join several sheets
2V5: USB (17 pins), DAC (BA1.1 BA4.1)
8N0: USB (CPS.2 CPT.2 RP7.1 RP8.1), DAC (16 pins)
8P0: USB (CPE.1 CPF.2 RP4.1 RP5.1), DAC (18 pins)
CK0: USB (RC2.1), DAC (UA1.25)
CK1: USB (RC1.1), DAC (UA1.48)
CK2: USB (RC3.2), DAC (UAA.25)
CK3: USB (RC4.2), DAC (UAA.48)
GND: USB (147 pins), DAC (116 pins)
L0: USB (UD2.P1), DAC (UA1.26)
L1: USB (UD2.N1), DAC (UA1.27)
L2: USB (UD2.M1), DAC (UA1.29)
L3: USB (UD2.L1), DAC (UA1.30)
L4: USB (UD2.K3), DAC (UA1.32)
L5: USB (UD2.J1), DAC (UA1.33)
L6: USB (UD2.H3), DAC (UA1.35)
L7: USB (UD2.H1), DAC (UA1.36)
L8: USB (UD2.G1), DAC (UA1.37)
L9: USB (UD2.F3), DAC (UA1.38)
LA: USB (UD2.E1), DAC (UA1.40)
LB: USB (UD2.D1), DAC (UA1.41)
LC: USB (UD2.C1), DAC (UA1.43)
LD: USB (UD2.B1), DAC (UA1.44)
LE: USB (UD2.A1), DAC (UA1.46)
LF: USB (UD2.A2), DAC (UA1.47)
R0: USB (UD2.A3), DAC (UAA.26)
R1: USB (UD2.A4), DAC (UAA.27)
R2: USB (UD2.A5), DAC (UAA.29)
R3: USB (UD2.A6), DAC (UAA.30)
R4: USB (UD2.A7), DAC (UAA.32)
R5: USB (UD2.A10), DAC (UAA.33)
R6: USB (UD2.A11), DAC (UAA.35)
R7: USB (UD2.A12), DAC (UAA.36)
R8: USB (UD2.B14), DAC (UAA.37)
R9: USB (UD2.C14), DAC (UAA.38)
RA: USB (UD2.D14), DAC (UAA.40)
RB: USB (UD2.E14), DAC (UAA.41)
RC: USB (UD2.F14), DAC (UAA.43)
RD: USB (UD2.G14), DAC (UAA.44)
RE: USB (UD2.K14), DAC (UAA.46)
RF: USB (UD2.L14), DAC (UAA.47)
VCL: USB (UD2.N14), DAC (RL3.2)
VCR: USB (UD2.P14), DAC (RR3.2)